# Altium schematic sheet IMU_sensors.SchDoc
size 431 x 279 mm; SheetNumber: 2; SheetTotal: 4
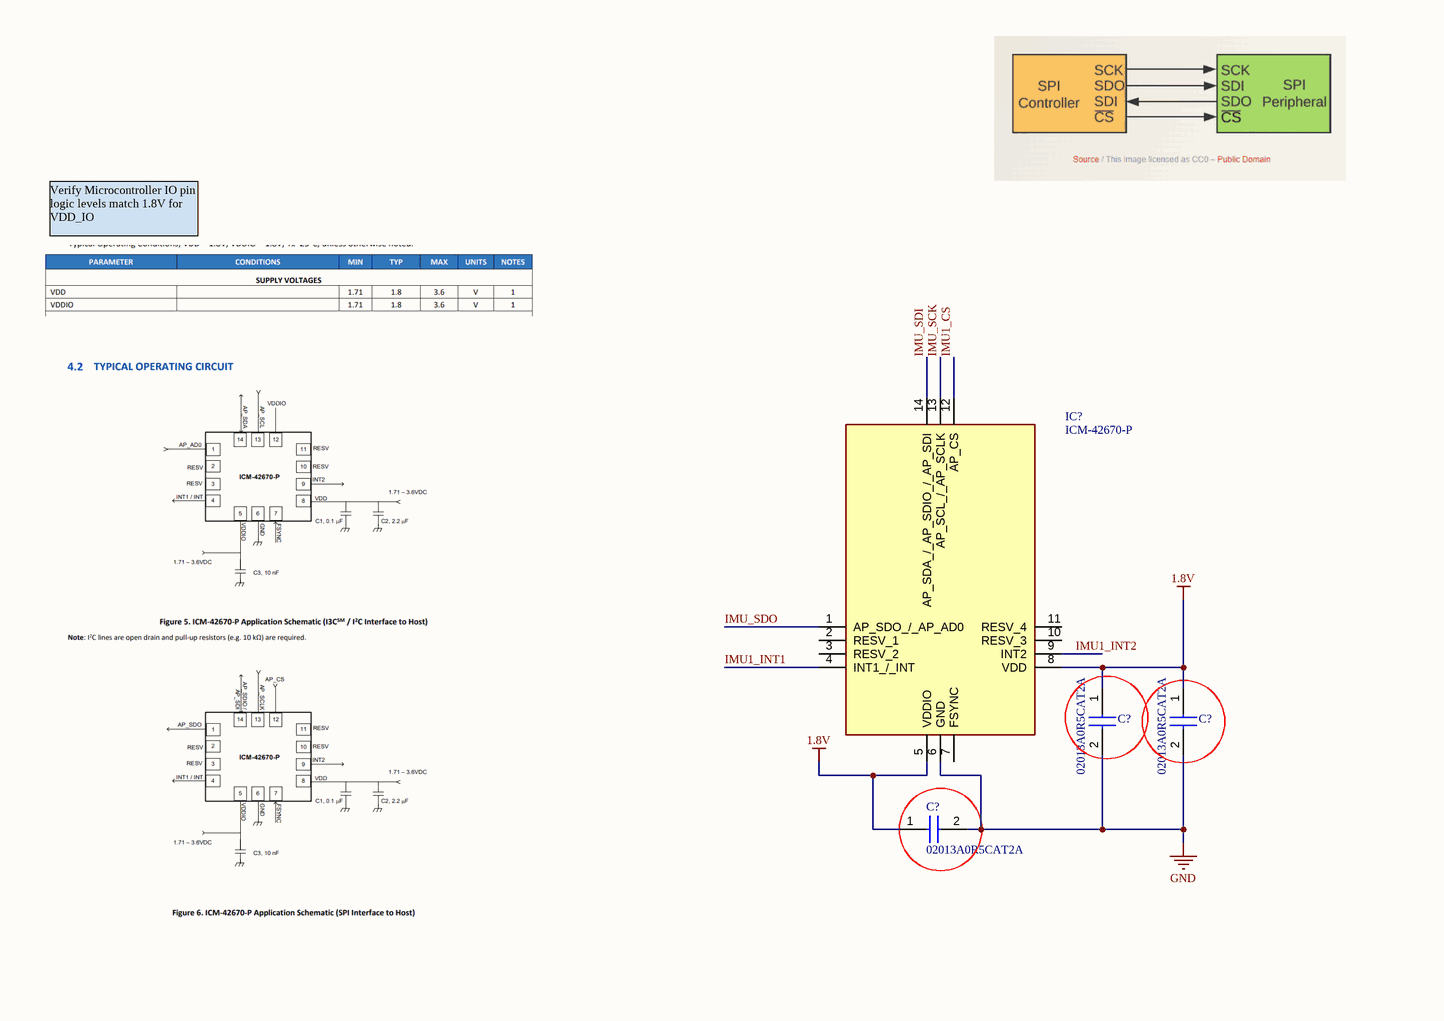
[diagram p0: IMU_sensors.SchDoc, left]
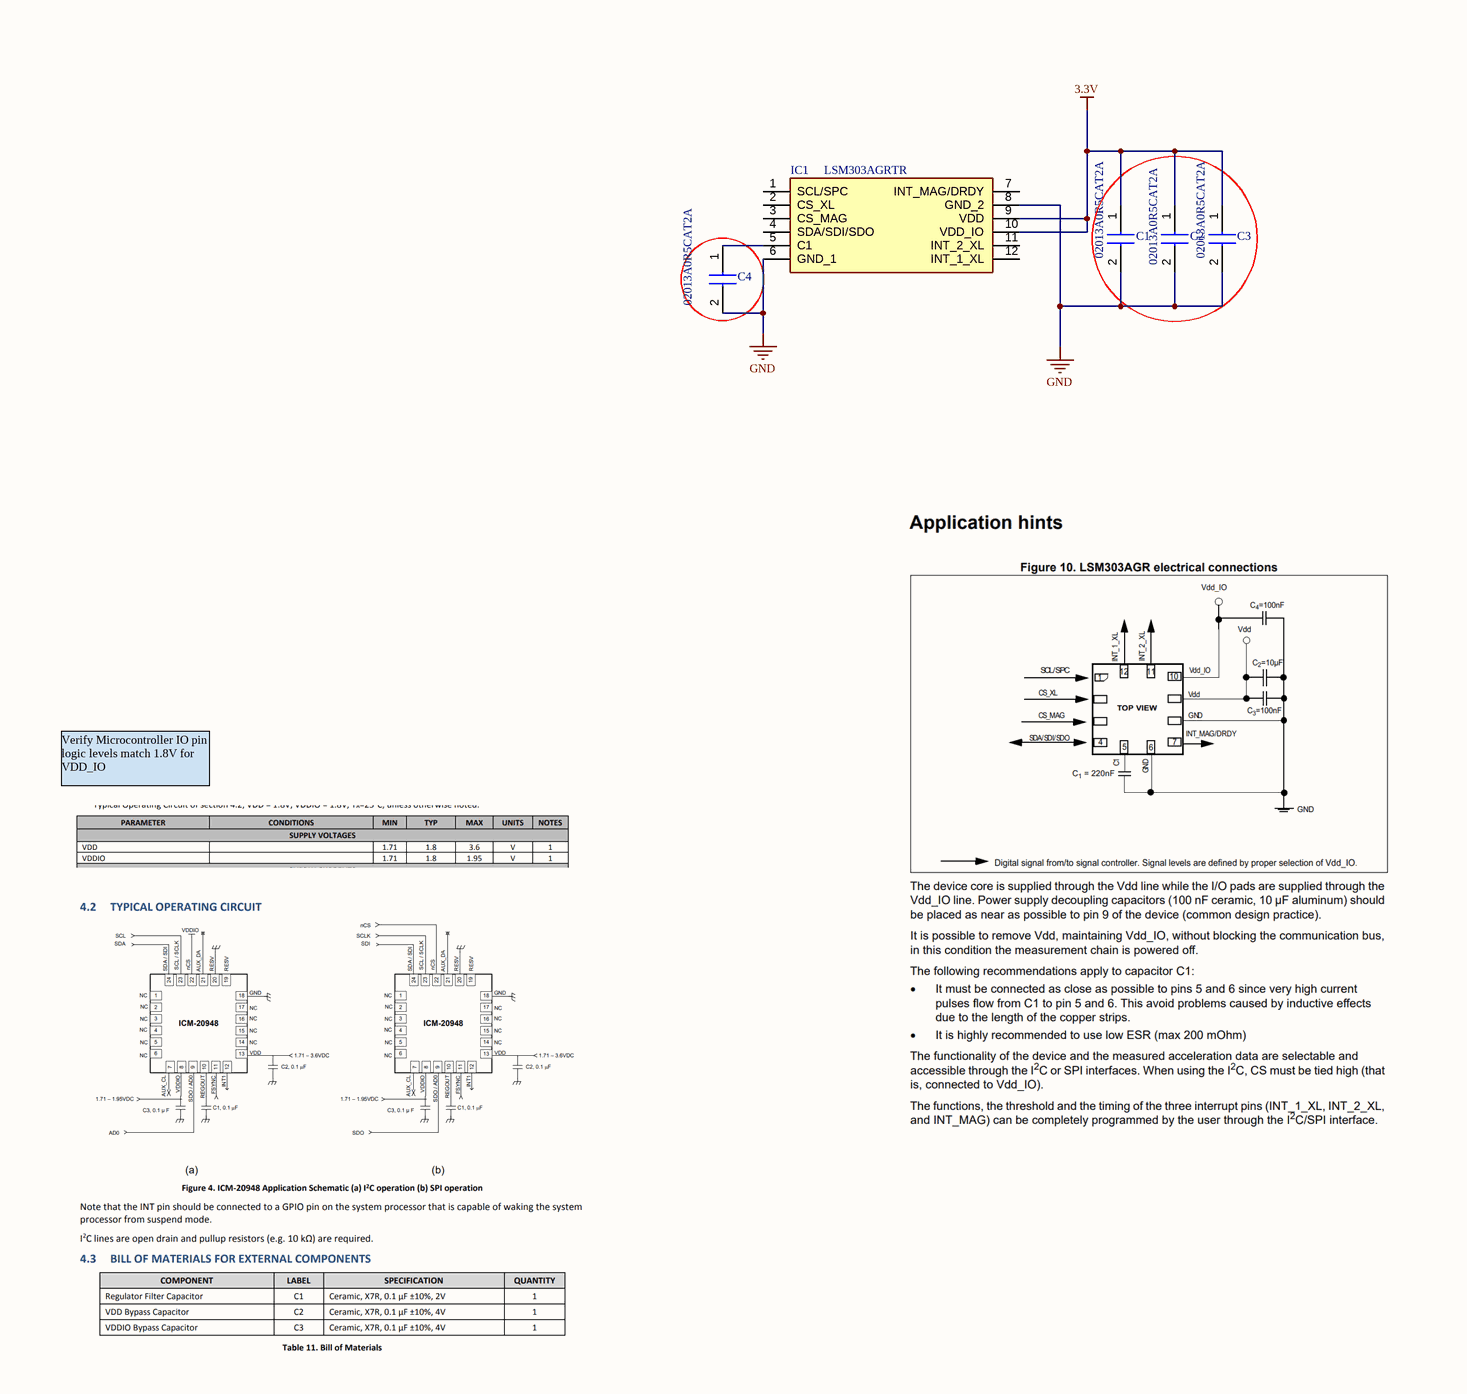
[diagram p1: IMU_sensors.SchDoc, right]

## Parts
(Parts that share a designator on the sheet are numbered #1, #2 ... from top to bottom, then left to right.)
C1  02013A0R5CAT2A  [CAPC0603X33N]
C2  02013A0R5CAT2A  [CAPC0603X33N]
C3  02013A0R5CAT2A  [CAPC0603X33N]
C4  02013A0R5CAT2A  [CAPC0603X33N]
C?#1  02013A0R5CAT2A  [CAPC0603X33N]
C?#2  02013A0R5CAT2A  [CAPC0603X33N]
C?#3  02013A0R5CAT2A  [CAPC0603X33N]
IC1  LSM303AGRTR  [LGA-12]
IC?  ICM-42670-P  [ICM42670P]

## Nets
1.8V: C?#1.1 C?#2.1 C?#3.1 IC?.5(VDDIO) IC?.8(VDD)
3.3V: C1.1 C2.1 C3.1 IC1.9(VDD) IC1.10(VDD_IO)
GND: C1.2 C2.2 C3.2 C4.2 C?#1.2 C?#2.2 C?#3.2 IC1.6(GND_1) IC1.8(GND_2) IC?.6(GND)
IMU1_CS: IC?.12(AP_CS)
IMU1_INT1: IC?.4(INT1_/_INT)
IMU1_INT2: IC?.9(INT2)
IMU_SCK: IC?.13(AP_SCL_/_AP_SCLK)
IMU_SDI: IC?.14(AP_SDA_/_AP_SDIO_/_AP_SDI)
IMU_SDO: IC?.1(AP_SDO_/_AP_AD0)
NetC4_1: C4.1 IC1.5(C1)

Not connected (* = marked no-connect by the designer): IC1 1(SCL/SPC) 2(CS_XL) 3(CS_MAG) 4(SDA/SDI/SDO) 7(INT_MAG/DRDY) 11(INT_2_XL) 12(INT_1_XL); IC? 2(RESV_1) 3(RESV_2) 7(FSYNC) 10(RESV_3) 11(RESV_4)

## Notes on the sheet
- Verify Microcontroller IO pin logic levels match 1.8V for VDD_IO
  1.8V Source also going to be needed. (Voltage divider or entirely seperate LDO
- DWG. NO.
- REV.
- SHT.
- THIS DOCUMENT AND THE DATA DISCLOSED HEREIN OR HEREWITH IS THE PROPERTY OF ALTIUM LIMITED AND MAY BE FREELY DISTRIBUTED IN WHOLE. NO RIGHTS ARE RESERVED OR EXPRESS OR IMPLIED WARANTEE GIVEN.
- REVISION
- DESCRIPTION
- DATE
- APPROVED
- ENG:
- APPROVALS
- PROJECT
- DSN:
- CHK:
- REFERENCE DOCUMENTS
- PROJECT REVISION:
- TITLE
- DOCUMENT REVISION:
- DESIGN ITEM:
- BOM:
- FAB DWG:
- PCB DWG:
- ASSY DWG:
- SCALE:
- SIZE
- B
- CAGE CODE
- FILE NAME
- DWG NO.
- SHEET
- OF
- REV

## Library data of the parts
C1-C4 C?#1-C?#3 = 02013A0R5CAT2A: Capacitor; Manufacturer_Name: AVX; Datasheet Link: http://www.mouser.com/catalog/supplier/library/pdf/AVXSurfaceMountCeramic.pdf; Height: 0.33mm; Manufacturer_Part_Number: 02013A0R5CAT2A; Mouser Part Number: 581-02013A0R5C; Mouser Price/Stock: https://www.mouser.co.uk/ProductDetail/AVX/02013A0R5CAT2A?qs=Thry1QCnmXB3nXCuXCgVMw%3D%3D; Arrow Part Number: 02013A0R5CAT2A; Arrow Price/Stock: https://www.arrow.com/en/products/02013a0r5cat2a/avx
IC1 = LSM303AGRTR: Integrated Circuit; Manufacturer_Name: STMicroelectronics; Datasheet Link: http://www.st.com/content/ccc/resource/technical/document/datasheet/74/c4/19/54/62/c5/46/13/DM00177685.pdf/files/DM00177685.pdf/jcr:content/translations/en.DM00177685.pdf; Manufacturer_Part_Number: LSM303AGRTR; Mouser Part Number: 511-LSM303AGRTR; Mouser Price/Stock: https://www.mouser.co.uk/ProductDetail/STMicroelectronics/LSM303AGRTR?qs=dTJS0cRn7oj2TlQhcroMCw%3D%3D; Arrow Part Number: LSM303AGRTR; Arrow Price/Stock: https://www.arrow.com/en/products/lsm303agrtr/stmicroelectronics?region=nac
IC? = ICM-42670-P: Integrated Circuit; Manufacturer_Name: TDK; Datasheet Link: https://3cfeqx1hf82y3xcoull08ihx-wpengine.netdna-ssl.com/wp-content/uploads/2021/07/DS-000451-ICM-42670-P-v1.0.pdf; Manufacturer_Part_Number: ICM-42670-P; Mouser Part Number: 410-ICM-42670-P; Mouser Price/Stock: https://www.mouser.co.uk/ProductDetail/TDK-InvenSense/ICM-42670-P?qs=iLbezkQI%252BsgK8sMF5V7fQQ%3D%3D; Arrow Part Number: ICM-42670-P; Arrow Price/Stock: https://www.arrow.com/en/products/icm-42670-p/invensense?region=nac